# EAGLE schematic light_switch_smd3_fork (EAGLE 7.7.0)
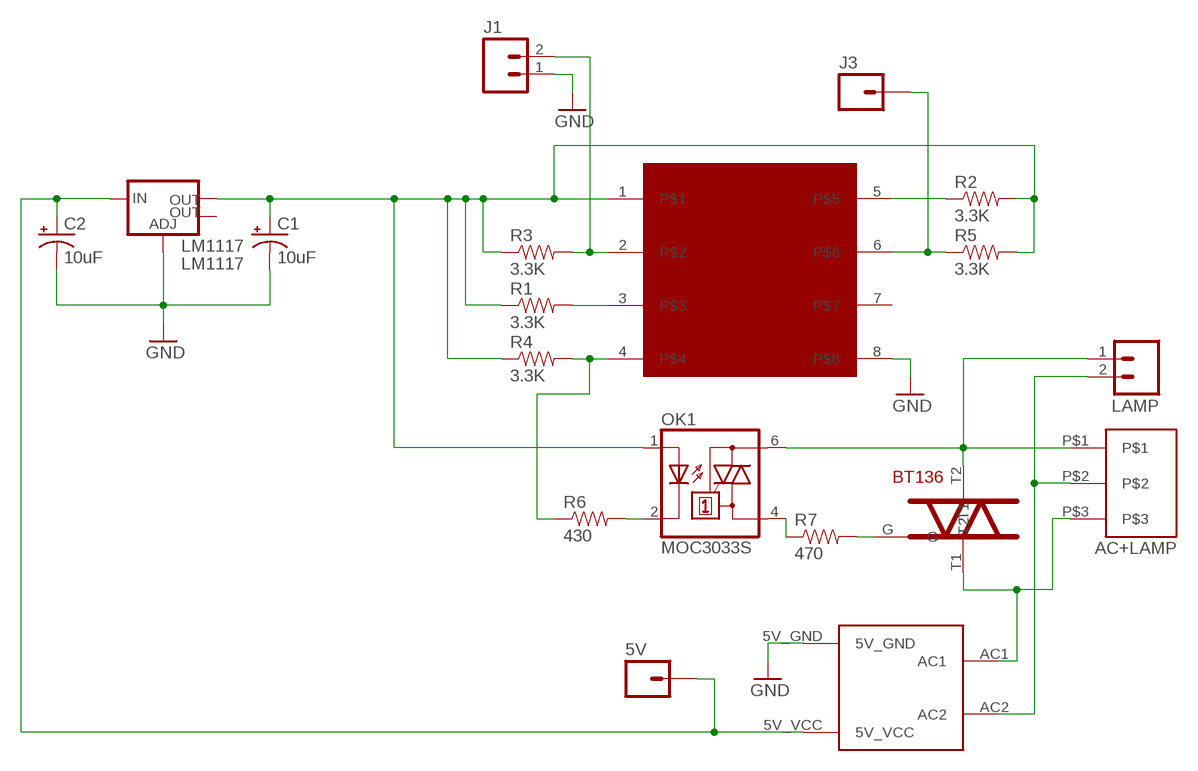
[diagram p0: schematic, sheet 1]

## Parts
5V  M01PTH  [1X01]
AC+LAMP  DG350-3.5-03P  [DG350-3.5-03P]
BT136  BT136  [BT136-PKG]
C1  10uF  10UF-6.3V-20%(0603)(TANT)"  [0603-POL]
C2  10uF  10UF-6.3V-20%(0603)(TANT)"  [0603-POL]
J1  M02PTH  [1X02]
J3  M01PTH  [1X01]
LAMP  M02PTH  [1X02]
LM1117  LM1117  V_REG_LM1117SOT223  [SOT223]
OK1  MOC3033S  [DIL6-SMD]
R1  3.3K  3.3MOHM-1/10W-1%(0603)  [0603-RES]
R2  3.3K  3.3MOHM-1/10W-1%(0603)  [0603-RES]
R3  3.3K  3.3MOHM-1/10W-1%(0603)  [0603-RES]
R4  3.3K  3.3MOHM-1/10W-1%(0603)  [0603-RES]
R5  3.3K  3.3MOHM-1/10W-1%(0603)  [0603-RES]
R6  430  RESISTOR0603  [0603-RES]
R7  470  RESISTOR0603  [0603-RES]
U$1  HI-LINK5V-ACDC  [AC5V]
U$2  ESP8266-01  [ESP8266-01]

## Nets
GND: C1.K(-) C2.K(-) J1.1 LM1117.1(ADJ) U$1.5V_GND U$2.8
N$1: J1.2 R3.2 U$2.2
N$2: R2.1 U$2.5
N$3: C1.A(+) LM1117.2(OUT) OK1.1(A) R1.1 R2.2 R3.1 R4.1 R5.2 U$2.1
N$5: OK1.2(C) R6.2
N$6: BT136.G R7.2
N$7: OK1.4(A1) R7.1
N$8: AC+LAMP.P$1 BT136.T2 LAMP.1 OK1.6(A2)
N$9: R4.2 R6.1 U$2.4
N$11: AC+LAMP.P$2 LAMP.2 U$1.AC2
N$12: AC+LAMP.P$3 BT136.T1 U$1.AC1
N$13: 5V.1 C2.A(+) LM1117.3(IN) U$1.5V_VCC
N$14: J3.1 R5.1 U$2.6
N$26: R1.2 U$2.3
Unconnected: LM1117.4(OUT) U$2.7

## Library data of the parts
5V J3 = SparkFun-Connectors:M01: Header 1 Standard 1-pin 0.1" header. Use with straight break away headers (SKU : PRT-00116), right angle break away headers (PRT-00553), swiss pins (PRT-00743), machine pins (PRT-00117), and female headers (PRT-00115). SMTSO-256-ET is a "flush mount" nut for a 4-40 screw. The older package used to be too tight, and did not allow it to sit properly thru the drill hit. The latest (0.165DIA) fits nice and snug.
AC+LAMP = myblog_library:DG350-3.5-03P: DG350-3.5-03P - terminal connector with 3.5mm step
BT136 = myblog_library:BT136
C1 C2 = SparkFun-Capacitors:10UF-6.3V-20%(0603)(TANT); PROD_ID: CAP-13210
J1 LAMP = SparkFun-Connectors:M02: Standard 2-pin 0.1" header. Use with - straight break away headers ( PRT-00116) - right angle break away headers (PRT-00553) - swiss pins (PRT-00743) - machine pins (PRT-00117) - female headers (PRT-00115) Molex polarized connector foot print use with: PRT-08233 with associated crimp pins and housings. 2.54_SCREWTERM for use with PRT-10571. 3.5mm Screw Terminal footprints for PRT-08084 5mm Screw Terminal footprints for use with PRT-08432
LM1117 = SparkFun-PowerIC:V_REG_LM1117: Voltage Regulator LM1117 Standard adjustable voltage regulator but in SMD form. Spark Fun Electronics SKU : COM-00595; PROD_ID: VREG-08170
OK1 = optocoupler:MOC30*: 6-Pin DIP Zero-Cross Optoisolators Triac Driver Output (250/400 Volt Peak) Source: Data sheet <http://www.fairchildsemi.com/ds/MO/MOC3031M.pdf> The old path of data sheet not more available 2013-05-06.; MF: FAIRCHILD SEMICONDUCTOR; MPN: MOC3033S-M; OC_FARNELL: unknown; OC_NEWARK: 05C2878
R1-R5 = SparkFun-Resistors:3.3MOHM-1/10W-1%(0603): RES-11057; PROD_ID: RES-11057
R6 R7 = SparkFun-Resistors:RESISTOR: Resistor Basic schematic elements and footprints for 0603, 1206, and PTH resistors.
U$1 = myblog_library:HI-LINK5V-ACDC
U$2 = myblog_library:ESP8266-01: This is the famous esp8266 module board

## Net classes
0 default: width 0.762 mm, drill 0.762 mm, clearance 0.762 mm